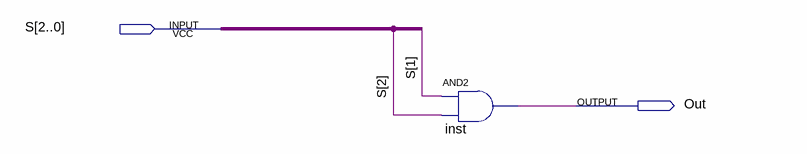
[diagram p0: schematic sheet]
// Quartus schematic input_func_detector.bdf as structural Verilog: 1 symbols, 2 pins
module input_func_detector (
  input  [2:0] S,
  output Out
);

  and inst (Out, S[1], S[2]);
endmodule
